# Altium schematic sheet LCD.SchDoc
size A4; SheetNumber: 2; SheetTotal: 8
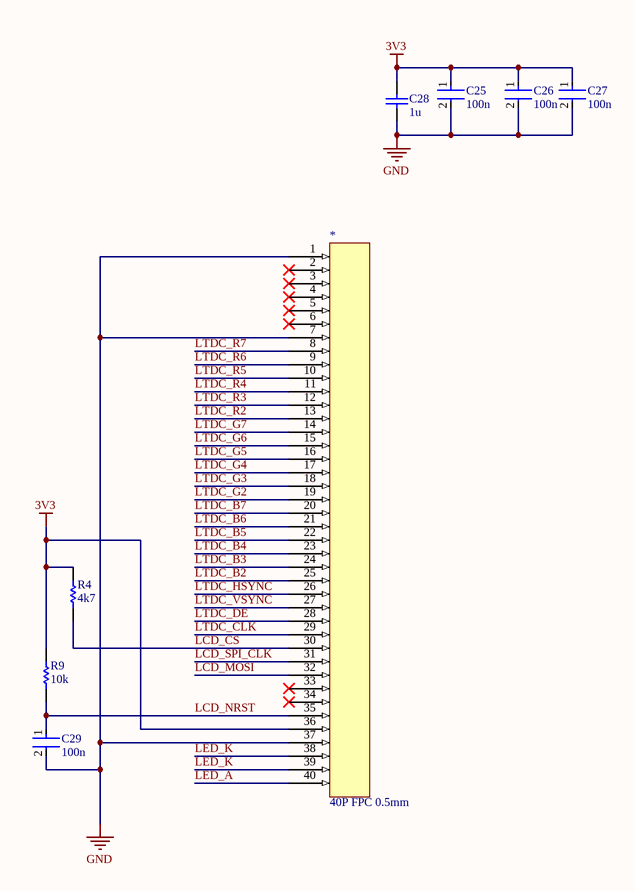
[diagram p0: LCD.SchDoc]

## Parts
*  40P FPC 0.5mm  [CONN_62684-402100ALF_AMP]
C25  100n  [FP-GRM188-0_1-e0_2_0_55-IPC_A]
C26  100n  [FP-GRM188-0_1-e0_2_0_55-IPC_A]
C27  100n  [FP-GRM188-0_1-e0_2_0_55-IPC_A]
C28  1u  [CAPC2013X135X45LL10T25]
C29  100n  [FP-GRM188-0_1-e0_2_0_55-IPC_A]
R4  4k7  [RESC1608X55X30ML15T15]
R9  10k  [RESC1608X55X30ML15T15]

## Nets
3V3: *.36 C25.1 C26.1 C27.1 C28.2 R4.2 R9.2
GND: *.1 *.7 *.37 C25.2 C26.2 C27.2 C28.1 C29.2
LCD_CS: *.30 R4.1
LCD_MOSI: *.32
LCD_NRST: *.35 C29.1 R9.1
LCD_SPI_CLK: *.31
LED_A: *.40
LED_K: *.38 *.39
LTDC_B2: *.25
LTDC_B3: *.24
LTDC_B4: *.23
LTDC_B5: *.22
LTDC_B6: *.21
LTDC_B7: *.20
LTDC_CLK: *.29
LTDC_DE: *.28
LTDC_G2: *.19
LTDC_G3: *.18
LTDC_G4: *.17
LTDC_G5: *.16
LTDC_G6: *.15
LTDC_G7: *.14
LTDC_HSYNC: *.26
LTDC_R2: *.13
LTDC_R3: *.12
LTDC_R4: *.11
LTDC_R5: *.10
LTDC_R6: *.9
LTDC_R7: *.8
LTDC_VSYNC: *.27

Not connected (* = marked no-connect by the designer): * 2* 3* 4* 5* 6* 33* 34*

## Library data of the parts
C25-C27 C29 = CMP-2006-02792-2: Chip Multilayer Ceramic Capacitors for General Purpose, 0603, 10uF, X5R, 15%, 20%, 6.3V; Packaging: Tape and Reel; Voltage Rating (DC): 6.3V; Width: 0.031inch; Termination: SMD/SMT; Dielectric: X5R; Package Quantity: 4000; Voltage Rating: 6.3V; Capacitance: 10uF; Case/Package: 0603; Min Operating Temperature: -55°C; Voltage: 6.3V; Length: 1.6mm; Thickness: 0.035inch; Lead Free: Lead Free; Depth: 0.8mm; Case Code (Imperial): 0603; Max Operating Temperature: 85°C; Material: Ceramic; Height: 0.8mm; Tolerance: 20%; Mount: Surface Mount; REACH SVHC: No SVHC; Radiation Hardening: No; Case Code (Metric): 1608
C28 = CMP-1662-00015-2: Chip Capacitor, 4.7 uF, +/- 10%, 16 V, -55 to 85 degC, 0805 (2012 Metric), RoHS, Tape and Reel; PartNumber: GRM21BR61C475KA88L; Voltage Rating (DC): 16 V; Capacitance: 4.7 uF; Type (Capacitors): X5R; Case\/Package: 0805; Pins: 2; DatasheetVersion: 03/2016; REACH SVHC: No SVHC; Tolerance: 10%; Width: 1.25 mm; Mount: Surface Mount; ComponentLink1Description: Manufacturer URL; Case Code (Metric): 2012; PackageDescription: 2-Pin Surface Mount Device, Body 2 x 1.25 mm; Height: 1.25 mm; Voltage Rating: 16 V; Max Operating Temperature: 85 degC; RoHSCompliant: true; Length: 2 mm; ComponentLink1URL: http://www.murata.com/; Mounting Technology: Surface Mount; Packaging: Tape and Reel; Min Operating Temperature: -55 degC; ComponentLink2Description: Datasheet; Case Code (Imperial): 0805; Radiation Hardening: No; Package Quantity: 3000; PackageReference: 0805; ComponentLink2URL: http://search.murata.co.jp/Ceramy/image/img/A01X/G101/ENG/GRM21BR61C475KA88-01.pdf
R4 R9 = CMP-2000-00182-1: Part Number: ERJ-3EKF1003V; Manufacturer: Panasonic